# EAGLE design clinique2000 v1 (EAGLE 9.7.0)
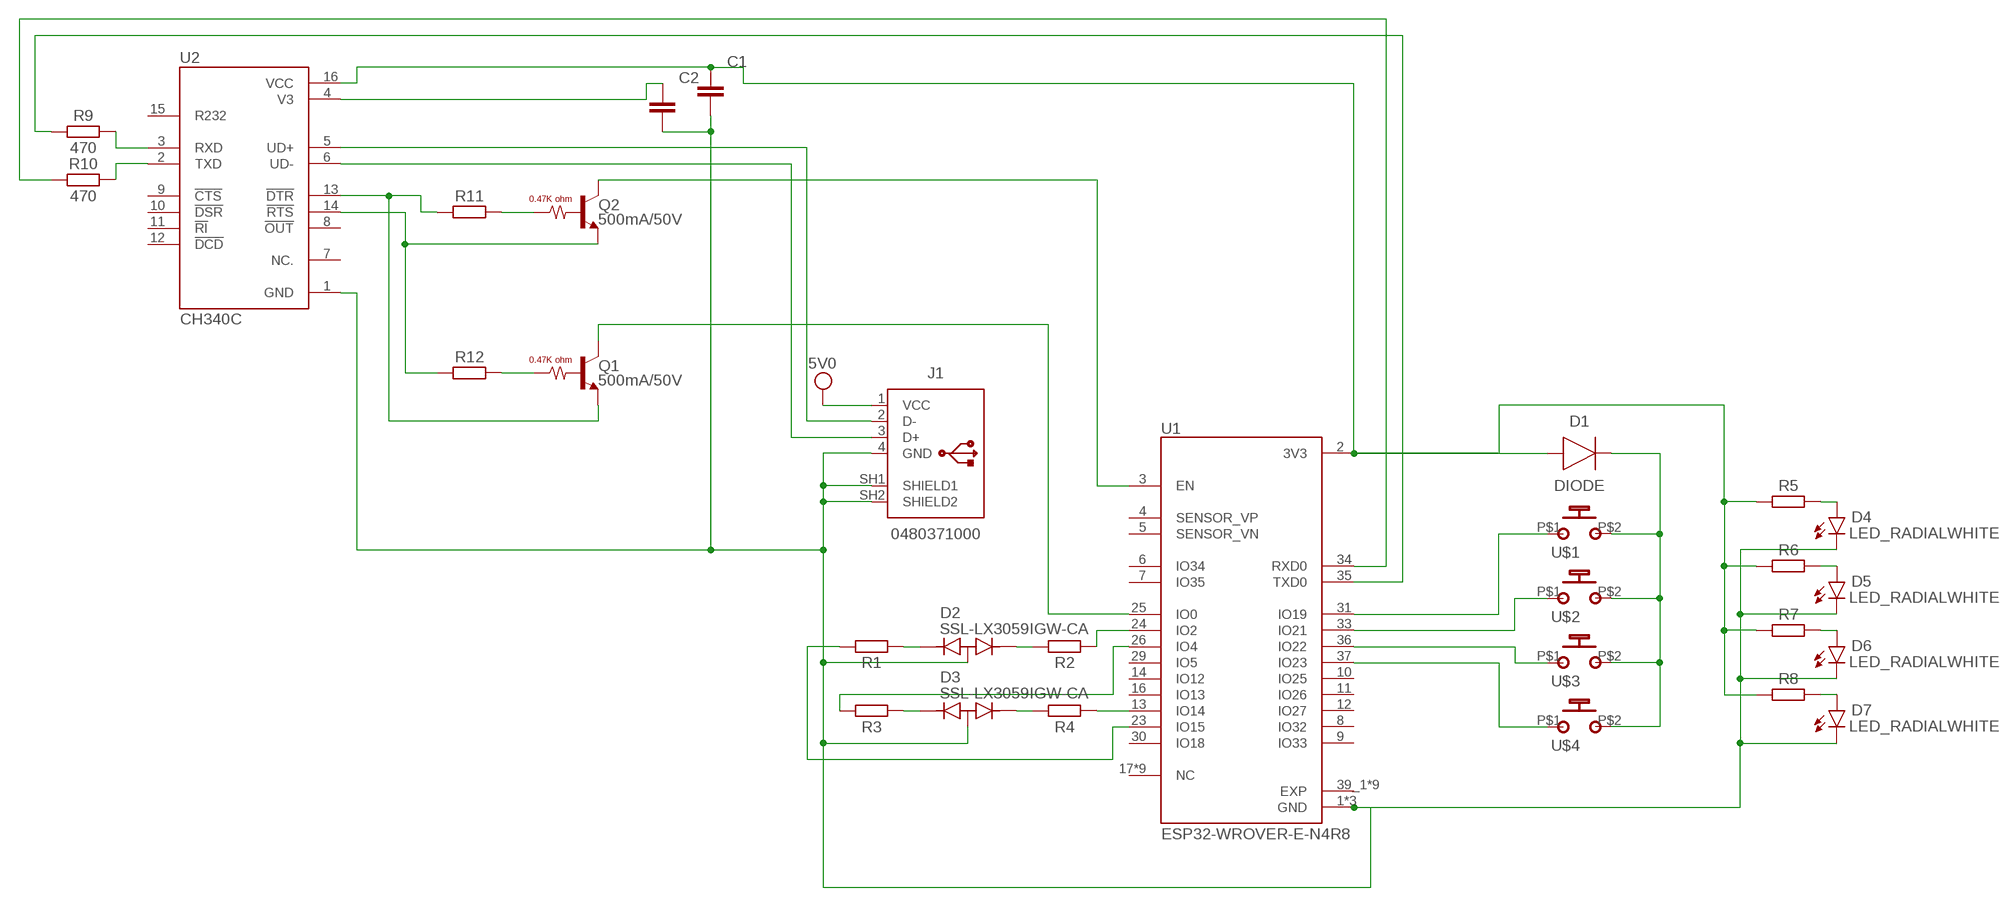
[diagram p0: schematic, sheet 1]

## Parts
C1  C_CHIP-0402(1005-METRIC)  [CAPC1005X60]
C2  C_CHIP-0402(1005-METRIC)  [CAPC1005X60]
D1  DIODE  DIODEDO-214AB(SMC)  [DIOM7959X625N]
D2  SSL-LX3059IGW-CA  [LED_SSL-LX3059IGW-CA]
D3  SSL-LX3059IGW-CA  [LED_SSL-LX3059IGW-CA]
D4  LED_RADIALWHITE  [LEDRD254W60D565H860B_W]
D5  LED_RADIALWHITE  [LEDRD254W60D565H860B_W]
D6  LED_RADIALWHITE  [LEDRD254W60D565H860B_W]
D7  LED_RADIALWHITE  [LEDRD254W60D565H860B_W]
J1  0480371000  [0480371000]
Q1  500mA/50V  TRANS_NPN_RES-DDTD142TC-7-F  [SOT23-3]
Q2  500mA/50V  TRANS_NPN_RES-DDTD142TC-7-F  [SOT23-3]
R1  R_AXIAL-7.2MM-PITCH  [RESAD724W46L381D178B]
R2  R_AXIAL-7.2MM-PITCH  [RESAD724W46L381D178B]
R3  R_AXIAL-7.2MM-PITCH  [RESAD724W46L381D178B]
R4  R_AXIAL-7.2MM-PITCH  [RESAD724W46L381D178B]
R5  R_AXIAL-7.2MM-PITCH  [RESAD724W46L381D178B]
R6  R_AXIAL-7.2MM-PITCH  [RESAD724W46L381D178B]
R7  R_AXIAL-7.2MM-PITCH  [RESAD724W46L381D178B]
R8  R_AXIAL-7.2MM-PITCH  [RESAD724W46L381D178B]
R9  470  R_AXIAL-7.2MM-PITCH  [RESAD724W46L381D178B]
R10  470  R_AXIAL-7.2MM-PITCH  [RESAD724W46L381D178B]
R11  R_AXIAL-7.2MM-PITCH  [RESAD724W46L381D178B]
R12  R_AXIAL-7.2MM-PITCH  [RESAD724W46L381D178B]
U1  ESP32-WROVER-E-N4R8  [XCVR_ESP32-WROVER-E-N4R8]
U2  CH340C  [SOIC127P600X180-16N]
U$1  MX1A-11NN  [CHERRY_MX1A-11NN_SWITCH]
U$2  MX1A-11NN  [CHERRY_MX1A-11NN_SWITCH]
U$3  MX1A-11NN  [CHERRY_MX1A-11NN_SWITCH]
U$4  MX1A-11NN  [CHERRY_MX1A-11NN_SWITCH]

## Nets
5V0: J1.1(VCC)
N$1: J1.2(D-) U2.5(UD+)
N$2: D1.1(C) U$1.P$2(S) U$2.P$2(S) U$3.P$2(S) U$4.P$2(S)
N$3: U1.37(IO23) U$4.P$1(P)
N$4: U1.36(IO22) U$3.P$1(P)
N$5: U1.31(IO19) U$1.P$1(P)
N$6: U1.33(IO21) U$2.P$1(P)
N$7: D4.A R5.2
N$8: D2.1(RED_C) R2.1
N$9: D2.3(GREEN_C) R1.2
N$10: D3.3(GREEN_C) R3.2
N$11: D3.1(RED_C) R4.1
N$12: R4.2 U1.13(IO14)
N$13: R3.1 U1.26(IO4)
N$14: R2.2 U1.24(IO2)
N$15: R1.1 U1.23(IO15)
N$16: J1.3(D+) U2.6(UD-)
N$17: D5.A R6.2
N$18: D6.A R7.2
N$19: D7.A R8.2
N$20: R9.2 U2.3(RXD)
N$21: C2.1 U2.4(V3)
N$22: R10.2 U2.2(TXD)
N$23: R9.1 U1.35(TXD0)
N$24: R10.1 U1.34(RXD0)
N$25: Q2.1(B) R11.2
N$26: Q1.1(B) R12.2
N$27: Q1.2(E) R11.1 U2.13(!DTR)
N$28: Q2.2(E) R12.1 U2.14(!RTS)
N$29: Q2.3(C) U1.3(EN)
N$30: Q1.3(C) U1.25(IO0)
N$31: C1.1 D1.2(A) R5.1 R6.1 R7.1 R8.1 U1.2(3V3) U2.16(VCC)
SHIELD1: C1.2 C2.2 D2.2(COMMON_A) D3.2(COMMON_A) D4.C D5.C D6.C D7.C J1.4(GND) J1.SH1(SHIELD1) J1.SH2(SHIELD2) U1.1(GND) U1.15(GND) U1.38(GND) U2.1(GND)
Unconnected: U1.4(SENSOR_VP) U1.5(SENSOR_VN) U1.6(IO34) U1.7(IO35) U1.8(IO32) U1.9(IO33) U1.10(IO25) U1.11(IO26) U1.12(IO27) U1.14(IO12) U1.16(IO13) U1.17(NC) U1.18(NC) U1.19(NC) U1.20(NC) U1.21(NC) U1.22(NC) U1.27(NC) U1.28(NC) U1.29(IO5) U1.30(IO18) U1.32(NC) U2.7(NC.) U2.8(!OUT) U2.9(!CTS) U2.10(!DSR) U2.11(!RI) U2.12(!DCD) U2.15(R232)

## Power pins joined to a net without a drawn wire
EXP: U1.39_1(EXP) U1.39_2(EXP) U1.39_3(EXP) U1.39_4(EXP) U1.39_5(EXP) U1.39_6(EXP) U1.39_7(EXP) U1.39_8(EXP) U1.39_9(EXP)

## Library data of the parts
C1 C2 = Capacitor:C: Capacitor - Generic; CATEGORY: Capacitor
D1 = Diode:DIODE: Diode Rectifier - Generic; CATEGORY: Diode; SUB-CATEGORY: Rectifier
D2 D3 = SSL-LX3059IGW-CA:SSL-LX3059IGW-CA: Check availability <https://pricing.snapeda.com/parts/SSL-LX3059IGW-CA/Lumex%20Opto/Components%20Inc./view-part?ref=eda>; AVAILABILITY: In Stock; CHECK_PRICES: https://www.snapeda.com/parts/SSL-LX3059IGW-CA/Lumex+Opto%252FComponents+Inc./view-part/?ref=eda; DESCRIPTION: Green, Red - LED Indication - Discrete 2.2V Green, 2V Red Radial - 3 Leads; MF: Lumex Opto/Components Inc.; MP: SSL-LX3059IGW-CA; PACKAGE: Radial-3 Lumex Opto/Components Inc.; PRICE: None; PURCHASE-URL: https://www.snapeda.com/api/url_track_click_mouser/?unipart_id=7526571&manufacturer=Lumex Opto/Components Inc.&part_name=SSL-LX3059IGW-CA&search_term=red green led; SNAPEDA_LINK: https://www.snapeda.com/parts/SSL-LX3059IGW-CA/Lumex+Opto%252FComponents+Inc./view-part/?ref=snap
D4-D7 = Opto-Electronic:LED_RADIAL: LED - Generic
J1 = Connector_USB:0480371000: USB(2.0) Type-A, PLUG, 4POS, SMD-THT-R/A Datasheet <https://www.molex.com/pdm_docs/sd/480371000_sd.pdf> Drawing <https://www.molex.com/pdm_docs/sd/480371000_sd.pdf>; CATEGORY: Connector; CONTACTS: 4; CURRENT_RATING: 1.5A; DESCRIPTION: CONN PLUG USB2.0 TYPEA 4P SMD RA; GENDER: Male; MANUFACTURER: Molex; MOUNT_TYPE: R/A; MPN: 0480371000; OPERATING_TEMP: -20° to +85°C; PART_STATUS: Active; ROHS_COMPLIANT: RoHS Compliant; SERIES: 48037; SUB-CATEGORY: USB; TYPE: USB-A; VOLTAGE_RATING: 150V AC (RMS)
Q1 Q2 = SparkFun-DiscreteSemi:TRANS_NPN_RES: NPN transistor with built in base resistor Current controlled device with built in current control for tighter layouts. Link to datasheet <http://www.diodes.com/_files/datasheets/ds30399.pdf>. SparkFun Products: SparkFun OpenSegment Serial Display - White <https://www.sparkfun.com/products/11644> SparkFun OpenSegment Serial Display - Red <https://www.sparkfun.com/products/11644>; PROD_ID: TRANS-11480
R1-R12 = Resistor:R: Resistor Fixed - Generic; CATEGORY: Resistor; SUB-CATEGORY: Fixed
U1 = ESP32-WROVER-E-N4R8:ESP32-WROVER-E-N4R8: Check availability <https://pricing.snapeda.com/parts/ESP32-WROVER-E-N4R8/Espressif%20Systems/view-part?ref=eda>; AVAILABILITY: In Stock; CHECK_PRICES: https://www.snapeda.com/parts/ESP32-WROVER-E-N4R8/Espressif+Systems/view-part/?ref=eda; DESCRIPTION: Bluetooth, WiFi 802.11b/g/n, Bluetooth v4.2 +EDR Transceiver Module 2.4GHz ~ 2.5GHz PCB Trace Surface Mount; MF: Espressif Systems; MP: ESP32-WROVER-E-N4R8; PACKAGE: SMD-38 Espressif Systems; PRICE: None; PURCHASE-URL: https://www.snapeda.com/api/url_track_click_mouser/?unipart_id=10844424&manufacturer=Espressif Systems&part_name=ESP32-WROVER-E-N4R8&search_term=wrover-e; SNAPEDA_LINK: https://www.snapeda.com/parts/ESP32-WROVER-E-N4R8/Espressif+Systems/view-part/?ref=snap
U2 = CH340C:CH340C: USB to serial chip CH340 Check availability <https://pricing.snapeda.com/parts/CH340C/WCH/view-part?ref=eda>; AVAILABILITY: Not in stock; CHECK_PRICES: https://www.snapeda.com/parts/CH340C/WCH/view-part/?ref=eda; DESCRIPTION: USB to serial chip CH340; MF: WCH; MP: CH340C; PACKAGE: None; PRICE: None; SNAPEDA_LINK: https://www.snapeda.com/parts/CH340C/WCH/view-part/?ref=snap
U$1-U$4 = MX1A-11NN:MX1A-11NN; CHECK_PRICES: https://www.snapeda.com/parts/MX1A-11NN/Cherry/view-part/?ref=eda; DESCRIPTION: Switch,Key,SPST-NO,Keyboard,Low Profile,10mA,12VDC,Face Place Mount,Std Force | Cherry Americas MX1A-11NN; DIGIKEY_PART_NUMBER: CH162-ND; MF: Cherry; MP: MX1A-11NN; PACKAGE: None; PURCHASE-URL: https://www.snapeda.com/api/url_track_click_mouser/?unipart_id=283337&manufacturer=Cherry&part_name=MX1A-11NN&search_term=cherry; SNAPEDA_LINK: https://www.snapeda.com/parts/MX1A-11NN/Cherry/view-part/?ref=snap

## Board
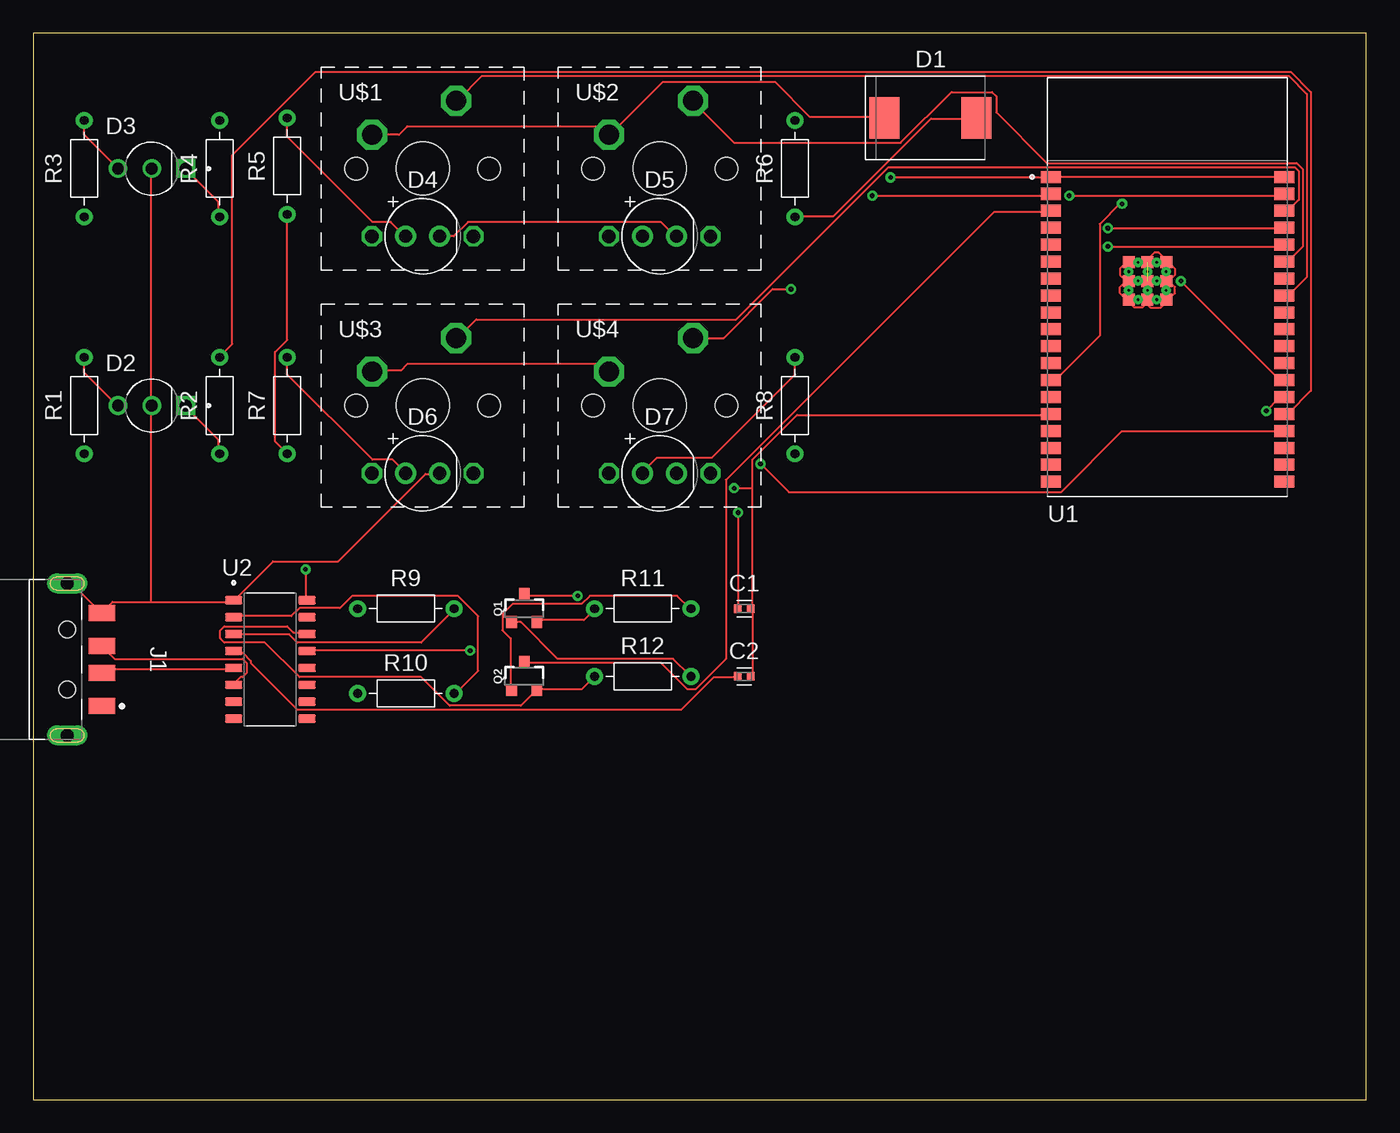
[diagram p1: board, top side]
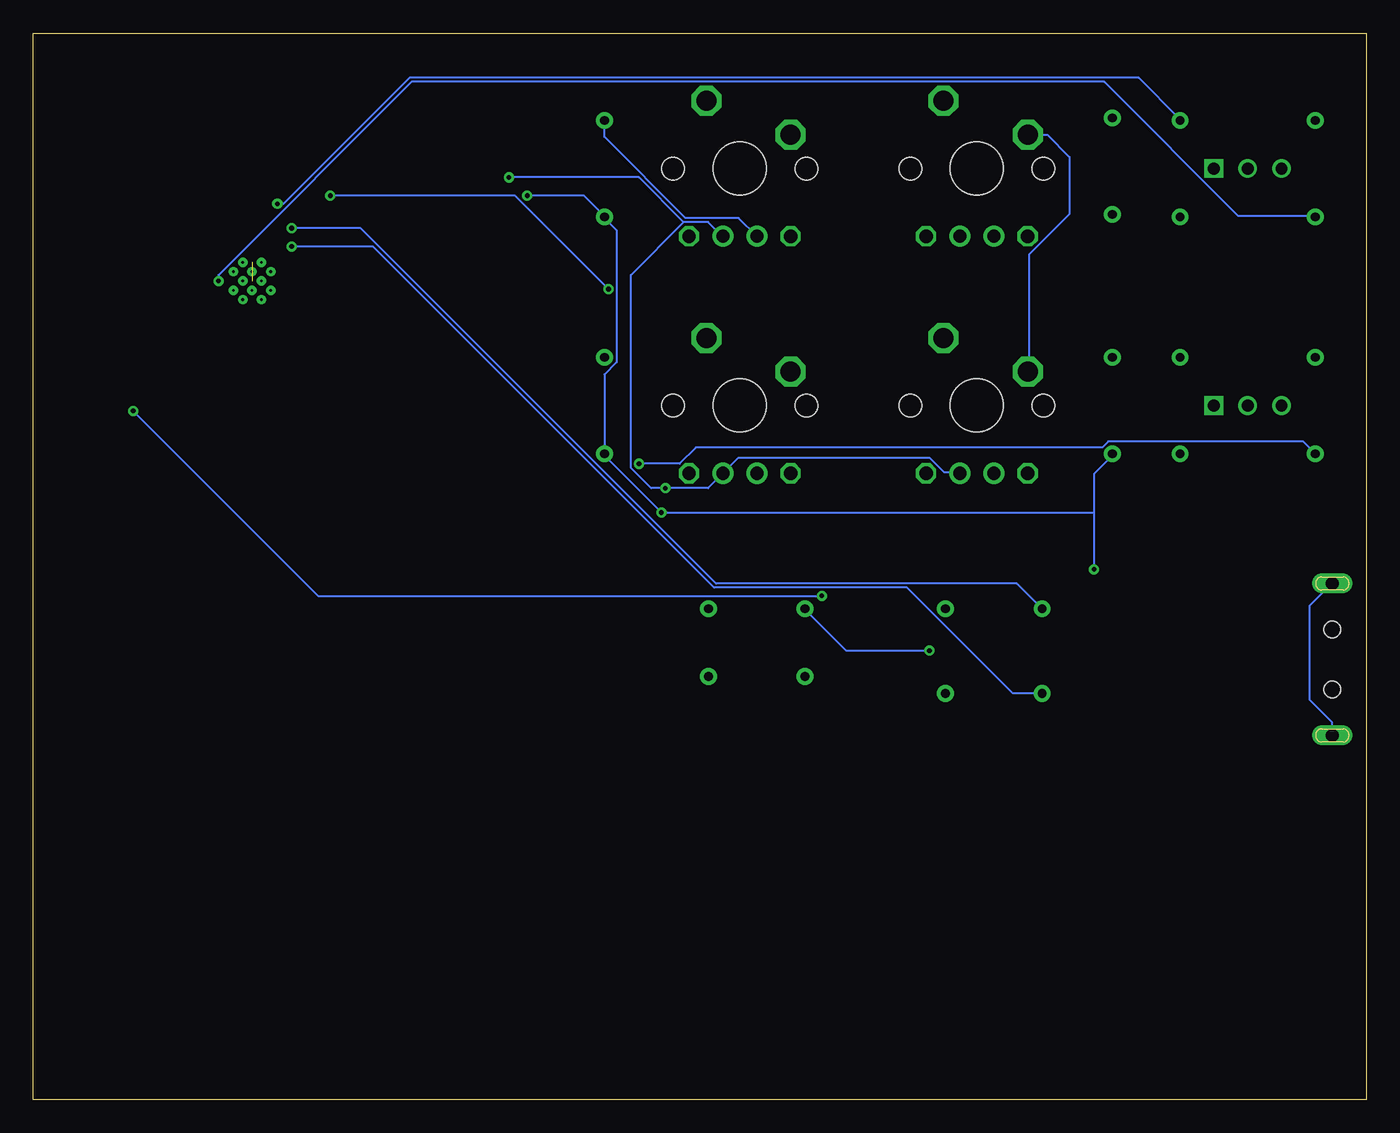
[diagram p2: board, bottom side, seen from below]

Size 100 x 80 mm. Coordinates in mm from the lower left corner, seen from the top.
Outline: 0,0 100,0 100,80 0,80 0,0
Copper layers (1*16): Top / Bottom
Stack-up Default Layer Stack: Top User Defined 0.035mm / Dielectric-1 User Defined 1.5mm / Bottom User Defined 0.035mm
Design rules: minimum copper width 6mil, minimum drill size 0.35mm, copper clearance wire_polygon to wire_polygon 6mil, copper clearance wire_polygon to pad_smd 6mil, copper clearance wire_polygon to via 6mil, copper clearance pad_smd to pad_smd 6mil, copper clearance pad_smd to via 6mil, copper clearance via to via 6mil, copper clearance smd to pad (same net) 6mil, copper clearance smd to via (same net) 6mil, copper clearance smd to smd (same net) 6mil, dimension clearance 40mil, restrict clearance 0mil, drill distance 6mil, keepout clearance 0mil

### Footprints (pad centres in the part's own frame; a part is rotated, then mirrored left to right if it is on the bottom)
CAPC1005X60 = smd 0.56 x 0.629: 1 -0.485,0; 2 0.485,0
DIOM7959X625N = smd 2.252 x 3.12: 1 -3.457,0; 2 3.457,0
LED_SSL-LX3059IGW-CA = drill 0.889 square: 1 2.54,0 | drill 0.889: 2 0,0; 3 -2.54,0
LEDRD254W60D565H860B_W = drill 0.981 pad 1.581: A -1.27,0; C 1.27,0
0480371000 = smd 1.2 x 2: 1 3.5,2.6; 2 1,2.6; 3 -1,2.6; 4 -3.5,2.6 | drill 1 long: SH1 -5.7,0; SH2 5.7,0 | hole 1.25: -2.25,0; 2.25,0
SOT23-3 = smd 0.8 x 0.9: 1 -0.95,-1; 2 0.95,-1; 3 0,1.1
RESAD724W46L381D178B = drill 0.66 pad 1.26: 1 -3.62,0; 2 3.62,0
XCVR_ESP32-WROVER-E-N4R8 = smd 1.5 x 0.9: 1 -8.75,8.26; 2 -8.75,6.99; 3 -8.75,5.72; 4 -8.75,4.45; 5 -8.75,3.18; 6 -8.75,1.91; 7 -8.75,0.64; 8 -8.75,-0.63; 9 -8.75,-1.9; 10 -8.75,-3.17; 11 -8.75,-4.44; 12 -8.75,-5.71; 13 -8.75,-6.98; 14 -8.75,-8.25; 15 -8.75,-9.52; 16 -8.75,-10.79; 17 -8.75,-12.06; 18 -8.75,-13.33; 19 -8.75,-14.6; 20 8.75,-14.6; 21 8.75,-13.33; 22 8.75,-12.06; 23 8.75,-10.79; 24 8.75,-9.52; 25 8.75,-8.25; 26 8.75,-6.98; 27 8.75,-5.71; 28 8.75,-4.44; 29 8.75,-3.17; 30 8.75,-1.9; 31 8.75,-0.63; 32 8.75,0.64; 33 8.75,1.91; 34 8.75,3.18; 35 8.75,4.45; 36 8.75,5.72; 37 8.75,6.99; 38 8.75,8.26 | smd 0.9 x 0.9: 39_1 -2.9,1.86; 39_2 -1.5,1.86; 39_3 -0.1,1.86; 39_4 -2.9,0.46; 39_5 -1.5,0.46; 39_6 -0.1,0.46; 39_7 -2.9,-0.94; 39_8 -1.5,-0.94; 39_9 -0.1,-0.94 | drill 0.2 pad 0.3: 40 -2.2,1.86; 41 -0.8,1.86; 42 -2.9,1.16; 43 -1.5,1.16; 44 -0.1,1.16; 45 -2.2,0.46; 46 -0.8,0.46; 47 -2.9,-0.24; 48 -1.5,-0.24; 49 -0.1,-0.24; 50 -2.2,-0.94; 51 -0.8,-0.94
SOIC127P600X180-16N = smd 1.31 x 0.62: 1 -2.75,4.445; 2 -2.75,3.175; 3 -2.75,1.905; 4 -2.75,0.635; 5 -2.75,-0.635; 6 -2.75,-1.905; 7 -2.75,-3.175; 8 -2.75,-4.445; 9 2.75,-4.445; 10 2.75,-3.175; 11 2.75,-1.905; 12 2.75,-0.635; 13 2.75,0.635; 14 2.75,1.905; 15 2.75,3.175; 16 2.75,4.445
CHERRY_MX1A-11NN_SWITCH = drill 1 octagon: BR1 -3.81,-5.08; BR2 3.81,-5.08 | drill 1.5 octagon: P$1 2.51,5.08; P$2 -3.81,2.54 | hole 3.988: 0,0 | hole 1.7: 5,0; -5,0

### Placement (x,y rotation side)
C1  53.34,36.83 0 top
C2  53.34,31.75 0 top
D1  67.31,73.66 0 top
D2  8.89,52.07 0 top
D3  8.89,69.85 0 top
D4  29.21,64.77 0 top
D5  46.99,64.77 0 top
D6  29.21,46.99 0 top
D7  46.99,46.99 0 top
J1  2.54,33.02 270 top
Q1  36.83,36.83 0 top
Q2  36.83,31.75 0 top
R1  3.81,52.07 90 top
R2  13.97,52.07 90 top
R3  3.81,69.85 90 top
R4  13.97,69.85 90 top
R5  19.05,70.04 90 top
R6  57.15,69.85 90 top
R7  19.05,52.07 90 top
R8  57.15,52.07 90 top
R9  27.94,36.83 0 top
R10  27.94,30.48 0 top
R11  45.72,36.83 0 top
R12  45.72,31.75 0 top
U1  85.09,60.96 0 top
U2  17.78,33.02 0 top
U$1  29.21,69.85 0 top
U$2  46.99,69.85 0 top
U$3  29.21,52.07 0 top
U$4  46.99,52.07 0 top

### Tracks (layer width: path | path; a pad name or v marks a point on that pad's centre or on a via)
EXP  (1 unrouted)
  Top 0.152: 85.19,61.42 85.04,61.42 U1.39_6 85.19,61.42 | 85.19,61.42 85.65,61.87 85.65,62.33 85.04,62.94 | 85.04,62.94 84.43,63.55 84.12,63.55 83.67,63.09 83.67,62.94 U1.39_2 | 85.04,62.94 U1.39_3 | 81.99,61.42 82.14,61.42 U1.39_4 81.99,61.42 | 81.99,61.42 81.53,61.87 81.53,62.33 82.14,62.94 U1.39_1 | 83.52,59.74 83.67,59.89 U1.39_8 83.52,59.74 | 83.52,59.74 83.21,59.44 82.6,59.44 82.3,59.74 82.3,59.89 U1.39_7 82.14,59.89 81.53,60.5 81.53,60.96 81.99,61.42 | 83.52,59.74 83.82,59.44 84.58,59.44 84.89,59.74 84.89,59.89 U1.39_9 85.04,59.89 85.65,60.5 85.65,60.96 85.19,61.42
N$1
  Top 0.152: U2.5 14.94,32.31 5.33,32.31 5.18,32.16 J1.2
N$2
  Top 0.152: U$3.P$2 25.45,54.71 27.58,54.71 28.04,55.17 42.67,55.17 43.13,54.71 U$4.P$2 | D1.1 63.7,73.76 58.22,73.76 55.63,76.35 47.24,76.35 43.28,72.39 U$2.P$2 43.13,72.39 42.52,73 28.04,73 27.43,72.39 U$1.P$2
  Bottom 0.152: U$1.P$2 23.93,72.39 22.25,70.71 22.25,66.45 25.3,63.4 25.3,54.71 U$3.P$2
N$3  (via drill 0.35)
  Top 0.152: v77.72,67.82 93.73,67.82 U1.37 | v56.84,60.81 55.47,60.81 51.82,57.15 U$4.P$1
  Bottom 0.152: v77.72,67.82 63.86,67.82 v56.84,60.81
N$4
  Top 0.152: U1.36 93.88,66.75 94.18,66.75 94.94,67.51 94.94,69.65 94.64,69.95 64.16,69.95 52.73,58.52 33.22,58.52 31.85,57.15 U$3.P$1
N$5
  Top 0.152: U1.31 93.88,60.35 94.18,60.35 95.56,61.72 95.56,75.44 94.18,76.81 33.68,76.81 31.85,74.98 U$1.P$1
N$6
  Top 0.152: U1.33 93.88,62.94 94.18,62.94 95.25,64.01 95.25,69.8 94.79,70.26 76.05,70.26 72.24,74.07 72.24,75.29 71.93,75.59 68.89,75.59 65.08,71.78 52.58,71.78 49.53,74.83 U$2.P$1
N$7
  Top 0.152: R5.2 19.05,72.24 25.45,65.84 26.82,65.84 27.89,64.77 D4.A
N$8
  Top 0.152: R2.1 13.87,48.46 13.87,49.53 11.43,51.97 D2.1
N$9
  Top 0.152: R1.2 3.81,54.56 6.25,52.12 D2.3
N$10
  Top 0.152: R3.2 3.81,72.39 D3.3
N$11
  Top 0.152: R4.1 13.87,66.29 13.87,67.36 11.43,69.8 D3.1
N$12  (via drill 0.35)
  Top 0.152: v81.69,67.21 81.53,67.21 80.01,65.68 80.01,57.3 76.81,54.1 76.35,54.1 U1.13
  Bottom 0.152: v81.69,67.21 81.23,67.21 71.78,76.66 17.07,76.66 14.02,73.61 R4.2
N$13  (via drill 0.35)
  Top 0.152: v86.11,61.42 93.42,54.1 93.73,54.1 U1.26
  Bottom 0.152: v86.11,61.42 86.11,61.87 71.63,76.35 19.66,76.35 9.6,66.29 3.81,66.29 R3.1
N$14
  Top 0.152: U1.24 93.88,51.51 94.18,51.51 95.86,53.19 95.86,75.59 94.34,77.11 21.18,77.11 14.94,70.87 14.94,56.69 14.02,55.78 R2.2
N$15  (via drill 0.35)
  Top 0.152: v54.56,47.7 56.69,45.57 77.11,45.57 81.69,50.14 93.73,50.14 U1.23
  Bottom 0.152: v54.56,47.7 51.51,47.7 50.29,48.92 19.81,48.92 19.36,49.38 4.72,49.38 3.81,48.46 R1.1
N$16
  Top 0.152: U2.6 15.09,31.24 15.54,31.7 15.7,31.7 16,32 16,32.77 15.7,33.07 6.1,33.07 5.18,33.98 J1.3
N$17
  Bottom 0.152: R6.2 57.15,72.24 51.05,66.14 47.09,66.14 D5.A
N$18
  Top 0.152: R7.2 19.05,54.41 25.45,48.01 26.98,48.01 27.89,47.09 D6.A
N$19
  Top 0.152: R8.2 57.15,54.41 50.9,48.16 46.79,48.16 45.72,47.09 D7.A
N$20
  Top 0.152: U2.3 15.09,34.9 19.2,34.9 19.81,34.29 29.11,34.29 31.55,36.73 R9.2
N$21
  Top 0.152: C2.1 52.73,31.7 51.05,31.7 48.62,29.26 19.81,29.26 16.31,32.77 16.31,32.92 15.7,33.53 15.09,33.53 U2.4
N$22
  Top 0.152: U2.2 15.09,36.27 19.36,36.27 19.96,36.88 23.01,36.88 23.93,37.8 31.85,37.8 33.38,36.27 33.38,32.16 31.7,30.48 R10.2
N$23  (via drill 0.35)
  Top 0.152: v80.62,65.38 93.73,65.38 U1.35
  Bottom 0.152: v80.62,65.38 75.44,65.38 48.77,38.71 26.21,38.71 24.38,36.88 R9.1
N$24  (via drill 0.35)
  Top 0.152: v80.62,64.01 93.73,64.01 U1.34
  Bottom 0.152: v80.62,64.01 74.52,64.01 48.92,38.41 34.44,38.41 26.52,30.48 R10.1
N$25
  Top 0.152: Q2.1 35.81,30.79 35.81,34.59 35.2,35.2 35.2,36.42 35.97,37.19 41.15,37.19 41.76,37.8 48.31,37.8 49.23,36.88 R11.2
N$26
  Top 0.152: Q1.1 35.97,35.81 36.58,35.81 39.32,33.07 48.01,33.07 49.23,31.85 R12.2
N$27  (via drill 0.35)
  Top 0.152: Q1.2 37.8,35.97 41.3,35.97 42.06,36.73 R11.1 | v32.77,33.68 20.57,33.68 U2.13
  Bottom 0.152: v32.77,33.68 39.01,33.68 42.06,36.73 R11.1
N$28
  Top 0.152: R12.1 42.06,31.7 41.15,30.79 37.8,30.79 Q2.2 37.64,30.63 36.58,29.57 31.24,29.57 29.11,31.7 19.96,31.7 17.37,34.29 14.33,34.29 14.02,34.59 14.02,35.2 14.33,35.51 19.05,35.51 19.51,35.05 20.42,35.05 U2.14
N$29
  Top 0.152: Q2.3 36.88,32.77 47.09,32.77 49.07,30.79 49.68,30.79 51.97,33.07 51.97,46.48 72.08,66.6 76.2,66.6 U1.3
N$30  (via drill 0.35)
  Top 0.152: v40.84,37.8 36.88,37.8 Q1.3 | v92.51,51.66 93.42,52.58 93.73,52.58 U1.25
  Bottom 0.152: v40.84,37.8 78.64,37.8 v92.51,51.66
N$31  (via drill 0.35)
  Top 0.152: v20.42,39.78 20.42,37.49 U2.16 | R5.1 19.05,57 18.14,56.08 18.14,49.38 19.05,48.46 R7.1 | v52.88,44.04 52.88,36.88 C1.1 | v62.94,67.82 76.2,67.82 U1.2 | D1.2 70.71,73.61 67.36,73.61 60.05,66.29 57.15,66.29 R6.1
  Bottom 0.152: 20.42,44.04 20.42,46.94 19.05,48.31 R7.1 | 20.42,44.04 v20.42,39.78 | v62.94,67.82 58.67,67.82 57.15,66.29 R6.1 57.15,66.14 56.24,65.23 56.24,55.32 57.15,54.41 R8.1 57.15,48.31 v52.88,44.04 20.42,44.04
SHIELD1  (via drill 0.35)
  Top 0.152: U1.38 93.73,69.19 76.35,69.19 U1.1 76.2,69.19 v64.31,69.19 | D4.C 31.55,64.77 32.61,65.84 47.09,65.84 48.16,64.77 D5.C | C2.2 53.95,31.85 53.95,36.73 C1.2 53.95,36.88 53.95,45.87 | 53.95,45.87 53.95,48.01 57.3,51.36 76.2,51.36 U1.15 | 8.84,37.34 5.94,37.34 5.18,36.58 J1.4 5.03,36.58 2.9,38.71 2.59,38.71 J1.SH1 | 8.84,37.34 14.94,37.34 U2.1 15.09,37.49 17.98,40.39 22.86,40.39 29.41,46.94 30.48,46.94 D6.C | 8.84,37.34 8.84,51.97 D2.2 8.84,52.12 8.84,69.8 D3.2 | v52.58,45.87 53.95,45.87
  Bottom 0.152: v64.31,69.19 54.56,69.19 51.21,65.84 | 51.21,65.84 49.38,65.84 48.31,64.77 D5.C | D6.C 30.48,47.09 31.7,47.09 32.77,48.16 47.09,48.16 D7.C 49.38,45.87 v52.58,45.87 53.65,45.87 55.17,47.4 55.17,61.87 51.21,65.84 | J1.SH2 2.59,27.43 2.59,28.35 4.27,30.02 4.27,37.03 2.59,38.71 J1.SH1